# EAGLE schematic iNodeSwitch_v0.1 (EAGLE 6.6.0)
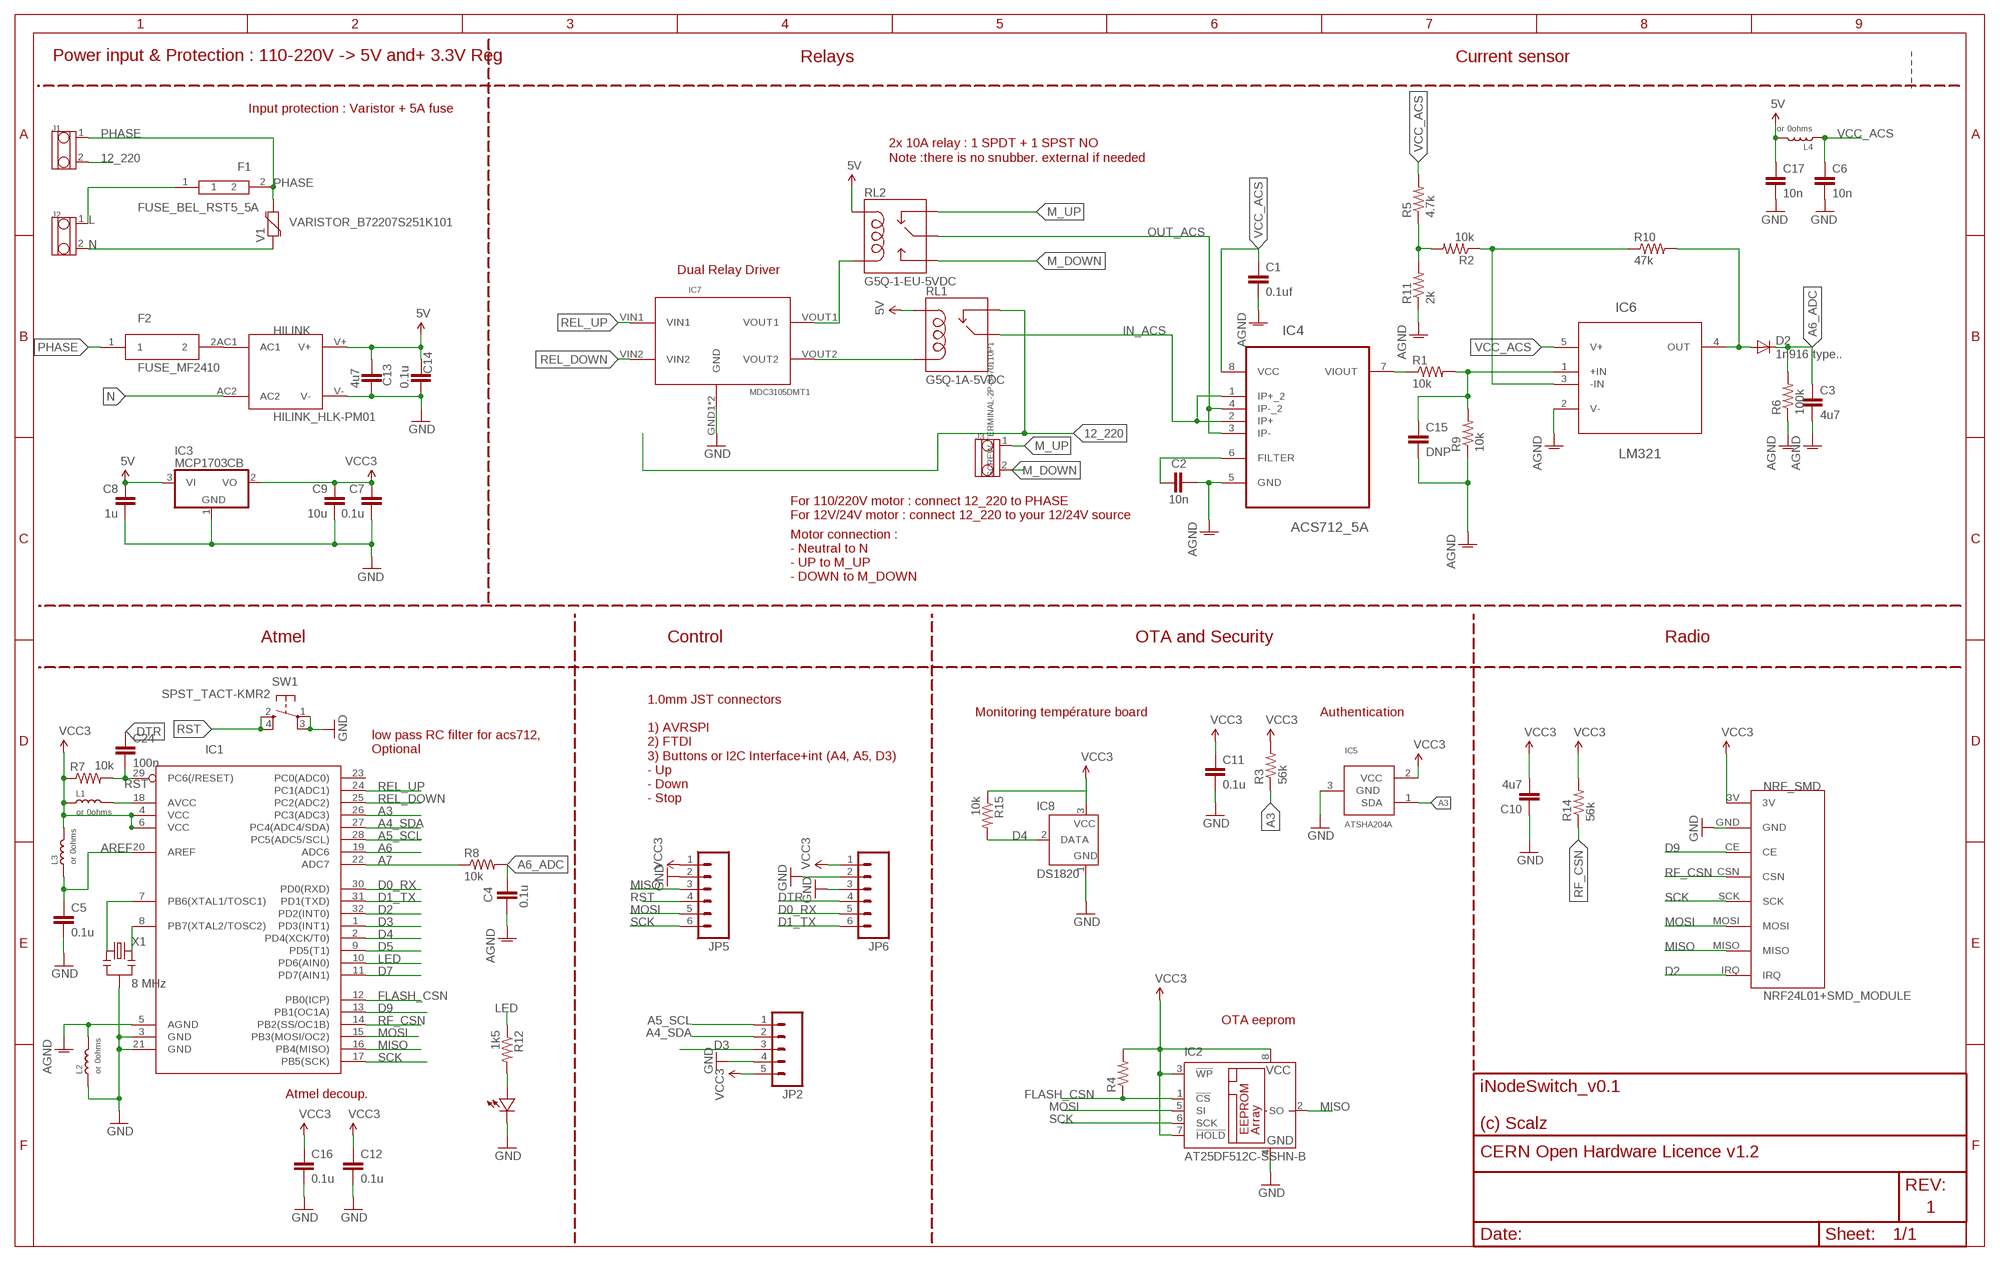
[diagram p0: schematic, sheet 1]

## Parts
C1  0.1uf  CAP0805-CAP  [0805-CAP]
C2  10n  CAP0805-CAP  [0805-CAP]
C3  4u7  CAP0805-CAP  [0805-CAP]
C4  0.1u  CAP0805-CAP  [0805-CAP]
C5  0.1u  CAP0805-CAP  [0805-CAP]
C6  10n  CAP0805-CAP  [0805-CAP]
C7  0.1u  CAP0805-CAP  [0805-CAP]
C8  1u  CAP0805-CAP  [0805-CAP]
C9  10u  CAP0805-CAP  [0805-CAP]
C10  4u7  CAP0805-CAP  [0805-CAP]
C11  0.1u  CAP0805-CAP  [0805-CAP]
C12  0.1u  CAP0805-CAP  [0805-CAP]
C13  4u7  CAP0805-CAP  [0805-CAP]
C14  0.1u  CAP0805-CAP  [0805-CAP]
C15  DNP  CAP0805-CAP  [0805-CAP]
C16  0.1u  CAP0805-CAP  [0805-CAP]
C17  10n  CAP0805-CAP  [0805-CAP]
C24  100n  CAP0805-CAP  [0805-CAP]
D1  LED0805  [0805-LED]
D2  1n916 type..  DIODESOD  [SOD-323]
F1  FUSE_BEL_RST5_5A  [FUSE_BEL_RST5_5A]
F2  FUSE_MF2410  [2410]
HILINK  HILINK_HLK-PM01  [HILINK_HLK-PM01]
IC1  ATMega-328  ATMEGA168/328TQFP32  [TQFP32-08]
IC2  AT25DF512C-SSHN-B  25AA080SN  [SO-08]
IC3  MCP1703CB  [SOT23]
IC4  ACS712_5A  ACS712ELCTR-20A-T  [SOIC127P600X175-8N]
IC5  ATSHA204A  [SOT23]
IC6  LM321  LM321MF  [SOT95P285X120-5N]
IC7  MDC3105DMT1  [MDC3105DMT1]
IC8  DS1820  [TO92-]
J1  SCREW-TERMINAL-2P-3470110P1  [2P-5.0]
J2  SCREW-TERMINAL-2P-3470110P1  [2P-5.0]
J3  SCREW-TERMINAL-2P-3470110P1  [2P-5.0]
JP2  M05SMD  [1X05-1MM]
JP5  M06SMD-1MM  [1X06-1MM]
JP6  M06SMD-1MM  [1X06-1MM]
L1  or 0ohms  INDUCTOR/FERRITE-BEAD-0805  [L0805]
L2  or 0ohms  INDUCTOR/FERRITE-BEAD-0805  [L0805]
L3  or 0ohms  INDUCTOR/FERRITE-BEAD-0805  [L0805]
L4  or 0ohms  INDUCTOR/FERRITE-BEAD-0805  [L0805]
NRF_SMD  NRF24L01+SMD_MODULE  [NRF24L01+SMD_MODULE]
R1  10k  RESISTOR0805-RES  [0805-RES]
R2  10k  RESISTOR0805-RES  [0805-RES]
R3  56k  RESISTOR0805-RES  [0805-RES]
R4  RESISTOR0805-RES  [0805-RES]
R5  4.7k  RESISTOR0805-RES  [0805-RES]
R6  100k  RESISTOR0805-RES  [0805-RES]
R7  10k  RESISTOR0805-RES  [0805-RES]
R8  10k  RESISTOR0805-RES  [0805-RES]
R9  10k  RESISTOR0805-RES  [0805-RES]
R10  47k  RESISTOR0805-RES  [0805-RES]
R11  2k  RESISTOR0805-RES  [0805-RES]
R12  1k5  RESISTOR0805-RES  [0805-RES]
R14  56k  RESISTOR0805-RES  [0805-RES]
R15  10k  RESISTOR0805-RES  [0805-RES]
RL1  G5Q-1A-5VDC  G5Q_SINGLE  [G5Q_SINGLE]
RL2  G5Q-1-EU-5VDC  RELAYPTH  [RELAY-G5Q]
SW1  SPST_TACT-KMR2  [KMR2]
V1  VARISTOR_B72207S251K101  [VARISTOR_B72207S251K101]
X1  8 MHz  RESONATORSMD  [RESONATOR-SMD]

## Nets
5V: C8.1 C13.1 C14.1 C17.1 HILINK.V+ IC3.3(VI) L4.2 RL1.1(COIL1) RL2.5(COIL1)
12_220: J1.2 RL1.3(NC)
A3: IC1.26(PC3(ADC3)) IC5.1(SDA) R3.1
A4_SDA: IC1.27(PC4(ADC4/SDA)) JP2.2
A5_SCL: IC1.28(PC5(ADC5/SCL)) JP2.1
A6: IC1.19(ADC6)
A6_ADC: C3.1 C4.2 D2.1(C) R6.2 R8.2
A7: IC1.22(ADC7) R8.1
AGND: C1.2 C2.2 C3.2 C4.1 C15.2 IC1.5(AGND) IC4.5(GND) IC6.2(V-) L2.2 R6.1 R9.1 R11.1
AREF: C5.1 IC1.20(AREF) L3.1
D0_RX: IC1.30(PD0(RXD)) JP6.5
D1_TX: IC1.31(PD1(TXD)) JP6.6
D2: IC1.32(PD2(INT0)) NRF_SMD.IRQ
D3: IC1.1(PD3(INT1)) JP2.3
D4: IC1.2(PD4(XCK/T0)) IC8.2(DATA) R15.2
D5: IC1.9(PD5(T1))
D7: IC1.11(PD7(AIN1))
D9: IC1.13(PB1(OC1A)) NRF_SMD.CE
DTR: C24.1 JP6.4
FLASH_CSN: IC1.12(PB0(ICP)) IC2.1(!CS) R4.1
GND: C5.2 C6.2 C7.2 C8.2 C9.2 C10.1 C11.2 C12.2 C13.2 C14.2 C16.2 C17.2 D1.MINUS HILINK.V- IC1.3(GND) IC1.21(GND) IC2.4(GND) IC3.1(GND) IC5.3(GND) IC7.GND1(GND) IC7.GND2(GND) IC8.1(GND) JP2.4 JP5.2 JP6.2 JP6.3 L2.1 NRF_SMD.GND SW1.1(P) SW1.3(P1) X1.2
IN_ACS: IC4.1(IP+_2) IC4.2(IP+) RL1.2(MAIN)
L: F1.1 J2.1
LED: IC1.10(PD6(AIN0)) R12.1
LM_OUT: D2.2(A) IC6.4(OUT) R10.2
M_DOWN: J3.2 RL2.3(NO)
M_UP: J3.1 RL2.4(NC)
MISO: IC1.16(PB4(MISO)) IC2.2(SO) JP5.3 NRF_SMD.MISO
MOSI: IC1.15(PB3(MOSI/OC2)) IC2.5(SI) JP5.5 NRF_SMD.MOSI
N: HILINK.AC2 J2.2 V1.1
N$1: C2.1 IC4.6(FILTER)
N$3: IC4.7(VIOUT) R1.1
N$4: IC1.18(AVCC) L1.2
N$6: IC7.VOUT2 RL1.5(COIL2)
N$8: NRF_SMD.CSN
N$9: F2.2 HILINK.AC1
N$10: C15.1 IC6.1(+IN) R1.2 R9.2
N$11: IC6.3(-IN) R2.1 R10.1
N$12: IC1.7(PB6(XTAL1/TOSC1)) X1.1
N$17: D1.PLUS R12.2
N$18: R2.2 R5.1 R11.2
N$19: IC7.VOUT1 RL2.1(COIL2)
N$21: IC1.8(PB7(XTAL2/TOSC2)) X1.3
OUT_ACS: IC4.3(IP-) IC4.4(IP-_2) RL2.2(MAIN)
PHASE: F1.2 F2.1 J1.1 V1.2
REL_DOWN: IC1.25(PC2(ADC2)) IC7.VIN2
REL_UP: IC1.24(PC1(ADC1)) IC7.VIN1
RF_CSN: IC1.14(PB2(SS/OC1B)) R14.1
RST: C24.2 IC1.29(PC6(/RESET)) JP5.4 R7.2 SW1.2(S) SW1.4(S1)
SCK: IC1.17(PB5(SCK)) IC2.6(SCK) JP5.6 NRF_SMD.SCK
VCC: C7.1 C9.1 C10.2 C11.1 C12.1 C16.1 IC1.4(VCC) IC1.6(VCC) IC2.3(!WP) IC2.7(!HOLD) IC2.8(VCC) IC3.2(VO) IC5.2(VCC) IC8.3(VCC) JP2.5 JP5.1 JP6.1 L1.1 L3.2 NRF_SMD.3V R3.2 R4.2 R7.1 R14.2 R15.1 ; supply symbol labelled VCC3
VCC_ACS: C1.1 C6.1 IC4.8(VCC) IC6.5(V+) L4.1 R5.2
Unconnected: IC1.23(PC0(ADC0))

## Notes on the sheet
- Power input & Protection : 110-220V -> 5V and+ 3.3V Reg | Relays | Current sensor
- Input protection : Varistor + 5A fuse
- 2x 10A relay : 1 SPDT + 1 SPST NO
- Note :there is no snubber. external if needed
- Dual Relay Driver
- For 110/220V motor : connect 12_220 to PHASE
  For 12V/24V motor : connect 12_220 to your 12/24V source
- Motor connection : 
  - Neutral to N
  - UP to M_UP
  - DOWN to M_DOWN
- Atmel | Control | OTA and Security | Radio
- Monitoring température board | Authentication
- low pass RC filter for acs712, 
  Optional
- 1.0mm JST connectors
  
  1) AVRSPI
  2) FTDI
  3) Buttons or I2C Interface+int (A4, A5, D3)
  - Up
  - Down
  - Stop
- OTA eeprom
- Atmel decoup.

## Library data of the parts
C1-C17 C24 = LowPowerLab:CAP: Capacitor Standard 0603 ceramic capacitor, and 0.1" leaded capacitor.
D1 = LowPowerLab:LED
D2 = SparkFun-DiscreteSemi:DIODE: Diode These are standard reverse protection diodes and small signal diodes. SMA package can handle up to about 1A. SOD-323 can handle about 200mA. What the SOD-323 package when ordering, there are some mfgs out there that are 5-pin packages.; PROD_ID: DIO-09646
F1 = rollershutter:FUSE_BEL_RST5_5A
F2 = rollershutter:FUSE_MF2410
HILINK = rollershutter:HILINK_HLK-PM01
IC1 = LowPowerLab:ATMEGA168/328: Atmel 32-pin 8-bit micro, 16k flash.; EAGLEUP: TQFP32-08
IC2 = microchip:25*: Serial EEPROM 4K/ 8K , SPI bus; MF: MICROCHIP; MPN: 25AA080/SN; OC_FARNELL: 1816072; OC_NEWARK: 92C7351
IC3 = linear:MCP1703: 250 mA, 16V, Low Quiescent Current LDO Regulator Source: http://ww1.microchip.com/downloads/en/DeviceDoc/22049b.pdf
IC4 = rollershutter:ACS712ELCTR-20A-T: Linear Current Sensor; MPN: ACS712ELCTR-20A-T; OC_FARNELL: 1329624; OC_NEWARK: 31M3133; PACKAGE: SOIC-8; SUPPLIER: Allegro
IC5 = rollershutter:ATSHA204A
IC6 = rollershutter:LM321MF: Low Power Single Op Amp; MPN: LM321MF; OC_FARNELL: 9779116; OC_NEWARK: 37K8530; PACKAGE: SOT-23-5; SUPPLIER: National Semiconductors
IC7 = rollershutter:MDC3105DMT1
IC8 = rollershutter:DS1820
J1-J3 = Connector:SCREW-TERMINAL-2P
JP2 = SparkFun-Connectors:M05: Header 5 Standard 5-pin 0.1" header. Use with straight break away headers (SKU : PRT-00116), right angle break away headers (PRT-00553), swiss pins (PRT-00743), machine pins (PRT-00117), and female headers (PRT-00115). Molex polarized connector foot print use with SKU : PRT-08230 with associated crimp pins and housings.
JP5 JP6 = SparkFun-Connectors:M06: Header 6 Standard 6-pin 0.1" header. Use with straight break away headers (SKU : PRT-00116), right angle break away headers (PRT-00553), swiss pins (PRT-00743), machine pins (PRT-00117), and female headers (PRT-00115). Molex polarized connector foot print use with SKU : PRT-08094 with associated crimp pins and housings. NOTES ON THE VARIANTS LOCK and LOCK_LONGPADS... This footprint was designed to help hold the alignment of a through-hole component (i.e. 6-pin header) while soldering it into place. You may notice that each hole has been shifted either up or down by 0.005 of an inch from it's more standard position (which is a perfectly straight line). This slight alteration caused the pins (the squares in the middle) to touch the edges of the holes. Because they are alternating, it causes a "brace" to hold the component in place. 0.005 has proven to be the perfect amount of "off-center" position when using our standard breakaway headers. Although looks a little odd when you look at the bare footprint, once you have a header in there, the alteration is very hard to notice. Also,if you push a header all the way into place, it is covered up entirely on the bottom side. This idea of altering the position of holes to aid alignment will be further integrated into the Sparkfun Library for other footprints. It can help hold any component with 3 or more connection pins.
L1-L4 = Discrete:INDUCTOR/FERRITE-BEAD
NRF_SMD = rollershutter:NRF24L01+SMD_MODULE
R1-R12 R14 R15 = LowPowerLab:RESISTOR: Resistor Basic schematic elements and footprints for 0603, 1206, and PTH resistors.
RL1 = rollershutter:G5Q_SINGLE
RL2 = rollershutter:RELAY: SPDT relay (COM-00101)
SW1 = adafruit:SPST_TACT: SMT 6mm switch, EVQQ2 series http://www.ladyada.net/library/eagle
V1 = rollershutter:VARISTOR_B72207S251K101
X1 = SparkFun:RESONATOR: Resonator Small SMD resonator. This is the itty bitty 10/20MHz resonators with built in caps. CSTCE10M0G55 and CSTCE20M0V53. Footprint has been reviewed closely but hasn't been tested yet.

## Net classes
1 Power: width 0.406 mm